# Altium project Shuttler_AMC.PrjPcb (part 7 of 20)

## Sheet PWR_DC_DC_EXAR2.SchDoc: Sayma AMC
size 420 x 297 mm; $$Internal___BlkDate: 0:12:25_2-9-18; $$Internal_NAME_PLACEHOLDER: a3sheet; $$Internal_Resolution: 00001mm; $$NotCommonProperty_@NAME: PWR_DC_DC_EXAR; $$NotCommonProperty_@PRINTORDER: 2; $$NotCommonProperty_@SHEET: 1; $$NotCommonProperty_@SHEETTOTAL: 1; CmpIndex: 9; Drawing Author: G.Kasprowicz; Drawing Number: Sayma AMC; Drawing Project: AMC FMC Carrier Board; Drawing Revision: 2.0; SymIndex: 2141; CheckedBy: P.Kulik,T.Przywozki,W.Ruclo; Author: G.Kasprowicz; CompanyName: WUT ISE; DrawnBy: G.Kasprowicz; Organization: WUT ISE; Address1: PW ISE; Address2: Nowowiejska 15/19 00-665 Warsaw; Address3: gkasprow@gmail.com; DocumentNumber: 14; Revision: 2; SheetNumber: 14; SheetTotal: 32; ModifiedBy: -; CheckedDate: -; Title2: Exar & 5V supply; DivGrp: WUT ISE; Designer: G.Kasprowicz; ModifiedDate: -; ProjectName: Sensor Box
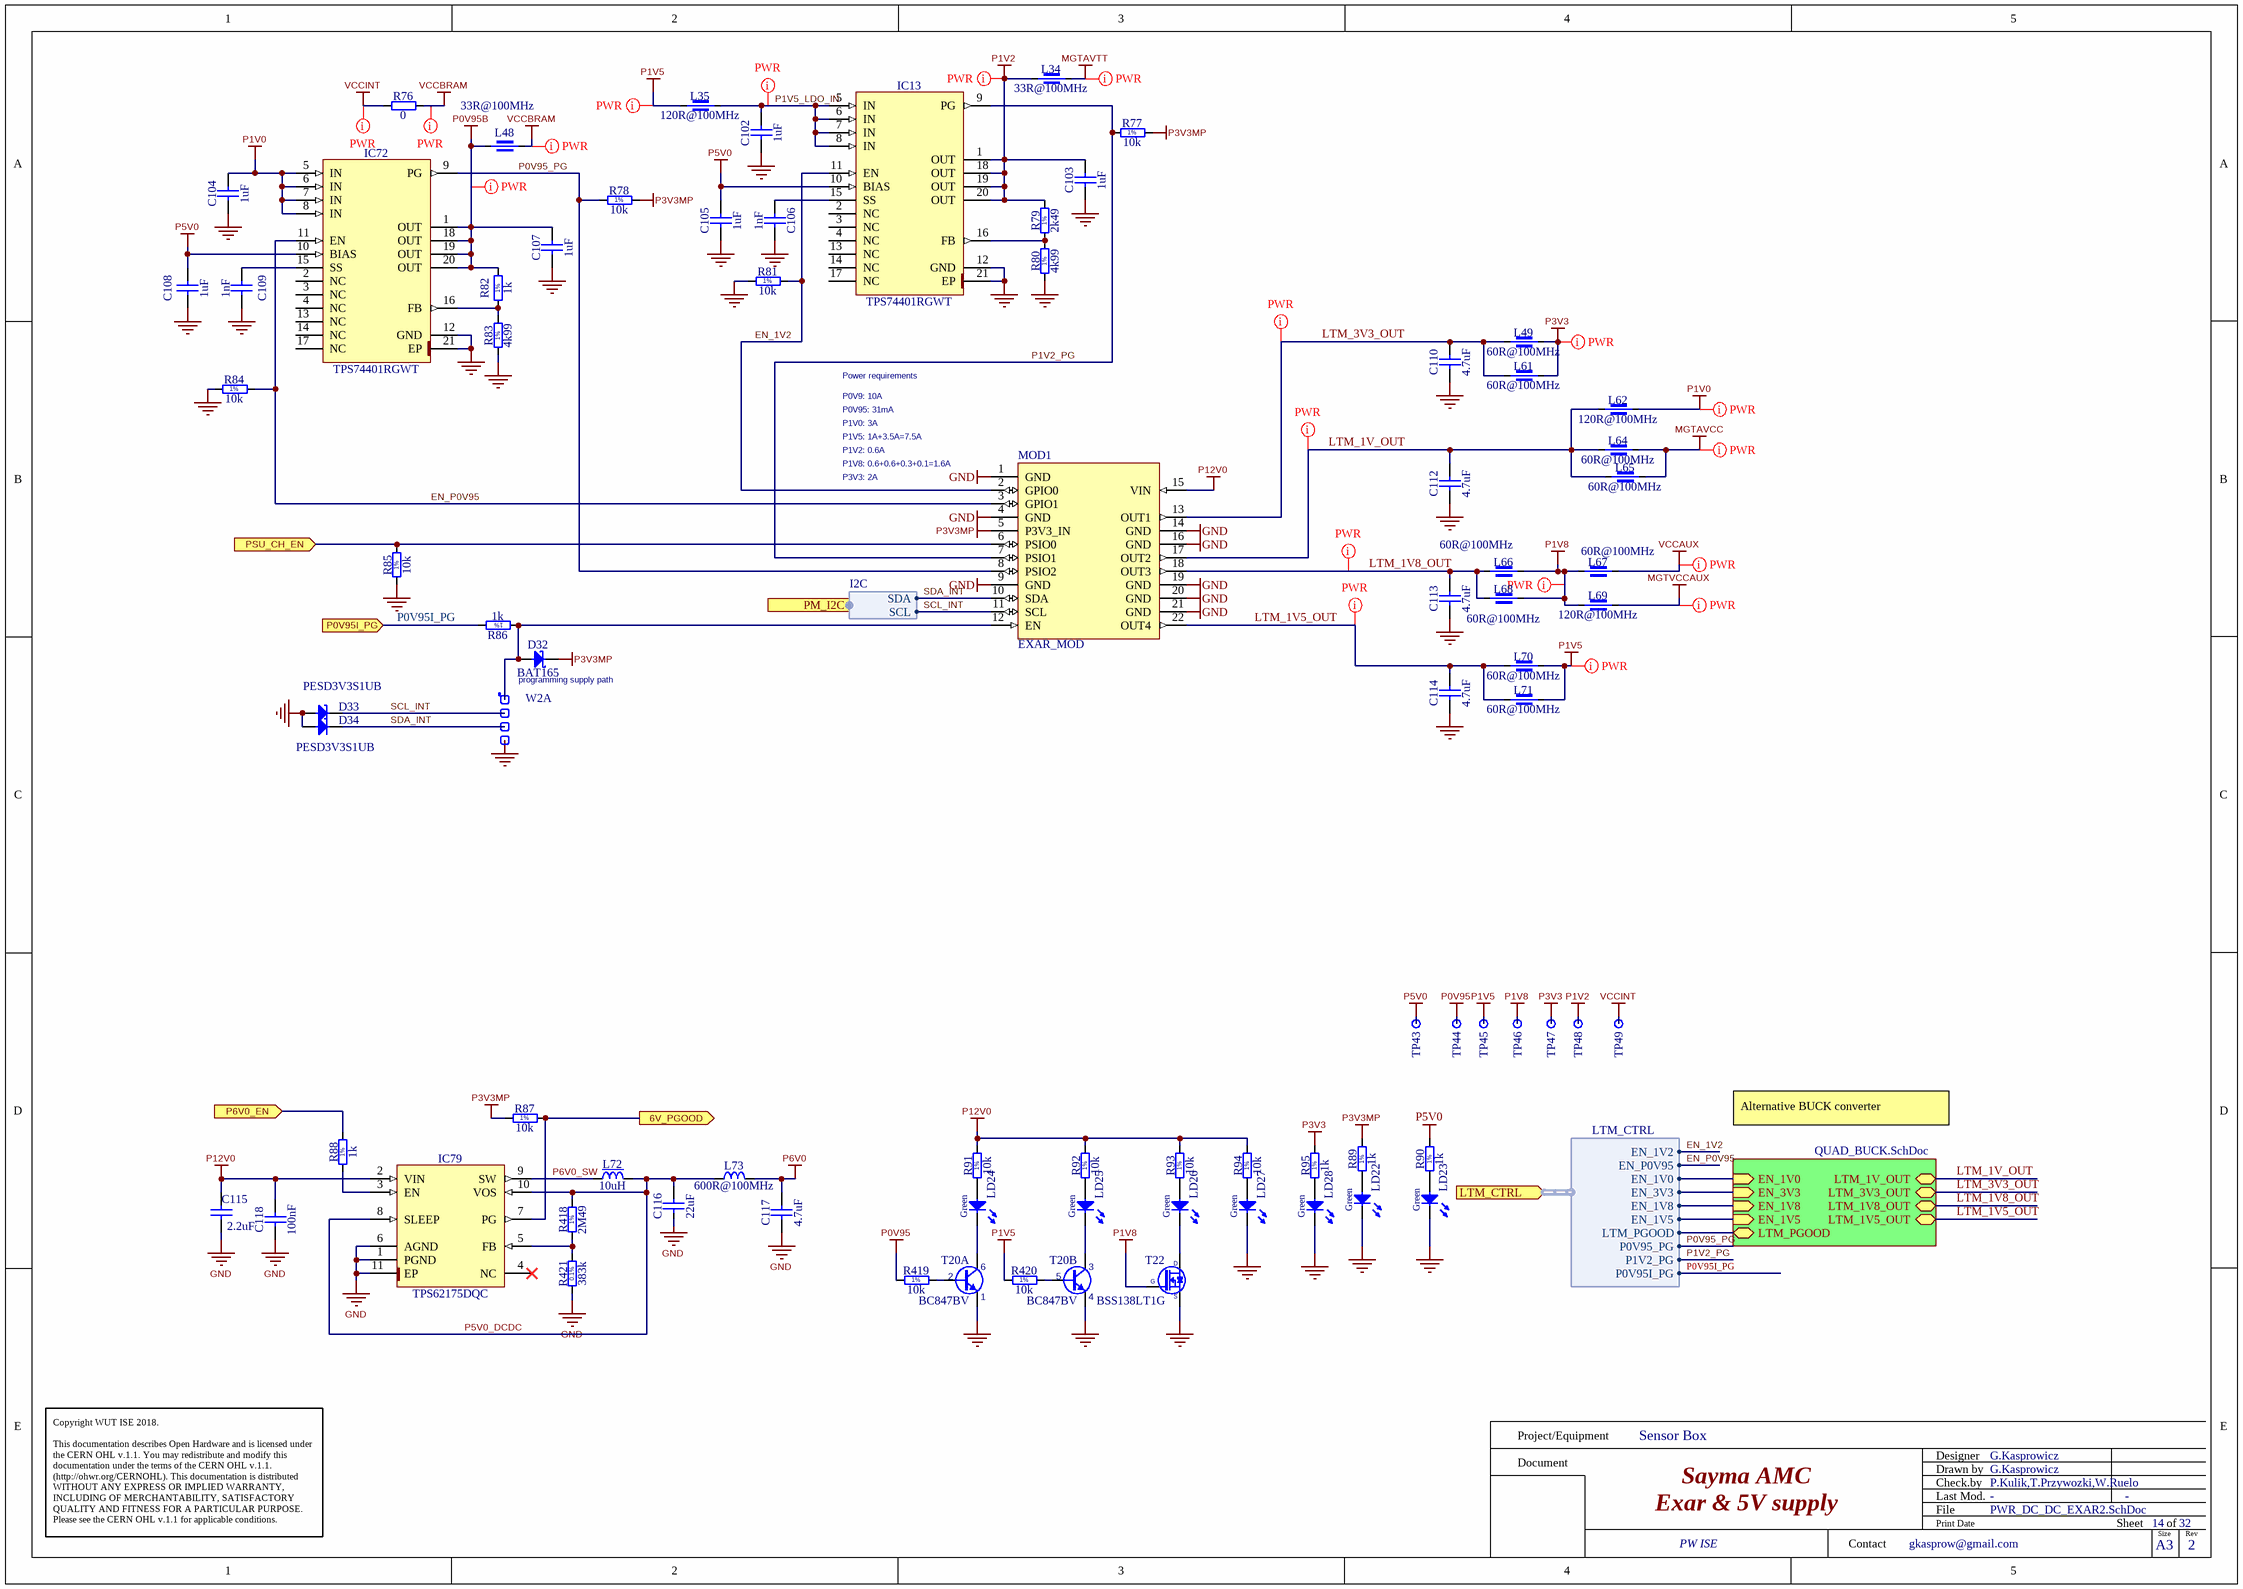
[diagram p12: PWR_DC_DC_EXAR2.SchDoc]

### Parts
C102  1uF  [CAPC1005X55N]
C103  1uF  [CAPC1005X55N]
C104  1uF  [CAPC1005X55N]
C105  1uF  [CAPC1005X55N]
C106  1nF  [CAPC1005X55N]
C107  1uF  [CAPC1005X55N]
C108  1uF  [CAPC1005X55N]
C109  1nF  [CAPC1005X55N]
C110  4.7uF  [CAPC1709X95N]
C112  4.7uF  [CAPC1709X95N]
C113  4.7uF  [CAPC1709X95N]
C114  4.7uF  [CAPC1709X95N]
C115  2.2uF  [CAPC1005X55N]
C116  22uF  [CAPC2012X135N]
C117  4.7uF  [CAPC1709X95N]
C118  100nF  [CAPC1005X55N]
D32  BAT165  [SOD2512X110N]
D33  PESD3V3S1UB  [SODFL1608X65N]
D34  PESD3V3S1UB  [SODFL1608X65N]
IC13  TPS74401RGWT  [QFN65P500X500X100-21N-S325]
IC72  TPS74401RGWT  [QFN65P500X500X100-21N-S325]
IC79  TPS62175DQC  [SON50P200X300X80-11N-R94X250]
L34  33R@100MHz  [INDC1608X95N]
L35  120R@100MHz  [INDC1608X95N]
L48  33R@100MHz  [INDC1608X95N]
L49  60R@100MHz  [INDC4516X180N]
L61  60R@100MHz  [INDC4516X180N]
L62  120R@100MHz  [INDC1608X95N]
L64  60R@100MHz  [INDC4516X180N]
L65  60R@100MHz  [INDC4516X180N]
L66  60R@100MHz  [INDC4516X180N]
L67  60R@100MHz  [INDC4516X180N]
L68  60R@100MHz  [INDC4516X180N]
L69  120R@100MHz  [INDC1608X95N]
L70  60R@100MHz  [INDC4516X180N]
L71  60R@100MHz  [INDC4516X180N]
L72  10uH  [IND_WURTH_WE-SPC-4838]
L73  600R@100MHz  [INDC2012X110N]
LD22  Green  [LED_KINGBRIGHT_KPH-1608CGCK]
LD23  Green  [LED_KINGBRIGHT_KPH-1608CGCK]
LD24  Green  [LED_KINGBRIGHT_KPH-1608CGCK]
LD25  Green  [LED_KINGBRIGHT_KPH-1608CGCK]
LD26  Green  [LED_KINGBRIGHT_KPH-1608CGCK]
LD27  Green  [LED_KINGBRIGHT_KPH-1608CGCK]
LD28  Green  [LED_KINGBRIGHT_KPH-1608CGCK]
MOD1  EXAR_MOD  [EXAR_MOD]
R76  0  [RESC2012X60N]
R77  10k  [RESC1005X40N]
R78  10k  [RESC1005X40N]
R79  2k49  [RESC1608X55N]
R80  4k99  [RESC1608X55N]
R81  10k  [RESC1005X40N]
R82  1k  [RESC1005X40N]
R83  4k99  [RESC1608X55N]
R84  10k  [RESC1005X40N]
R85  10k  [RESC1005X40N]
R86  1k  [RESC1005X40N]
R87  10k  [RESC1005X40N]
R88  1k  [RESC1005X40N]
R89  1k  [RESC1005X40N]
R90  1k  [RESC1005X40N]
R91  10k  [RESC1005X40N]
R92  10k  [RESC1005X40N]
R93  10k  [RESC1005X40N]
R94  10k  [RESC1005X40N]
R95  1k  [RESC1005X40N]
R418  2M49  [RESC1608X55N]
R419  10k  [RESC1005X40N]
R420  10k  [RESC1005X40N]
R421  383k  [RESC1608X55N]
T20  BC847BV  [SOTFL50P160X60-6N]  (parts A,B of 2)
T22  BSS138LT1G  [SOT95P240X110-3N]
TP43  Test Point  [TPS127]  (value not drawn)
TP44  Test Point  [TPS127]  (value not drawn)
TP45  Test Point  [TPS127]  (value not drawn)
TP46  Test Point  [TPS127]  (value not drawn)
TP47  Test Point  [TPS127]  (value not drawn)
TP48  Test Point  [TPS127]  (value not drawn)
TP49  Test Point  [TPS127]  (value not drawn)
W2  Header 4  [SAMTEC_MTLW-104-07-L-S-250]  (value not drawn)  (parts A,D of 4)
W11  Header 4  [SAMTEC_MTLW-104-07-L-S-250]  (value not drawn)  (parts B,C of 4)

### Sub-sheets
U_QUAD_BUCK = QUAD_BUCK.SchDoc: LTM_1V_OUT (bidir), LTM_1V5_OUT (bidir), EN_1V0 (in), EN_1V5 (in), EN_3V3 (in), EN_1V8 (in), LTM_PGOOD (bidir), LTM_3V3_OUT (bidir), LTM_1V8_OUT (bidir)

### Ports
6V_PGOOD (out), LTM_CTRL (in, harness LTM_CTRL), P0V95I_PG (in), P6V0_EN (in), PM_I2C (harness I2C), PSU_CH_EN (in)

### Harnesses
LTM_CTRL: EN_1V0, EN_3V3, EN_1V8, EN_1V5, LTM_PGOOD, EN_1V2, EN_P0V95, P0V95_PG, P1V2_PG, P0V95I_PG
I2C: SCL, SDA

### Nets
GND: C102.1 C103.1 C104.1 C105.1 C106.2 C107.1 C108.1 C109.2 C110.1 C112.1 C113.1 C114.1 C115.1 C116.1 C117.1 C118.1 D33.2(A) D34.2(A) IC13.12(GND) IC13.21(EP) IC72.12(GND) IC72.21(EP) IC79.1(PGND) IC79.6(AGND) IC79.11(EP) LD22.1(C) LD23.1(C) LD27.1(C) LD28.1(C) MOD1.1(GND) MOD1.4(GND) MOD1.9(GND) MOD1.14(GND) MOD1.16(GND) MOD1.19(GND) MOD1.20(GND) MOD1.21(GND) R80.1 R81.1 R83.1 R84.1 R85.1 R421.1 T20.1(E) T20.4(E) T22.2(S) W2.4
MGTAVCC: L64.2 L65.2
MGTAVTT: L34.2
MGTVCCAUX: L69.1
P0V95: R419.1 TP44.1
P0V95B: C107.2 IC72.1(OUT) IC72.18(OUT) IC72.19(OUT) IC72.20(OUT) L48.1 R82.2
P1V0: C104.2 IC72.5(IN) IC72.6(IN) IC72.7(IN) IC72.8(IN) L62.1
P1V2: C103.2 IC13.1(OUT) IC13.18(OUT) IC13.19(OUT) IC13.20(OUT) L34.1 R79.2 TP48.1
P1V5: L35.2 L70.2 L71.2 R420.1 TP45.1
P1V8: L66.2 L67.1 L68.2 L69.2 T22.1(G) TP46.1
P3V3: L49.2 L61.2 R95.2 TP47.1
P3V3MP: D32.1(C) MOD1.5(P3V3_IN) R77.2 R78.2 R87.1 R89.2
P5V0: C105.2 C108.2 IC13.10(BIAS) IC72.10(BIAS) R90.2 TP43.1
P6V0: C117.2 L73.2
P12V0: C115.2 C118.2 IC79.2(VIN) MOD1.15(VIN) R91.2 R92.2 R93.2 R94.2
VCCAUX: L67.2
VCCBRAM: L48.2 R76.2
VCCINT: R76.1 TP49.1
EN_1V0: sheet U_QUAD_BUCK/EN_1V0, port LTM_CTRL.EN_1V0
EN_1V2: IC13.11(EN) MOD1.2(GPIO0) R81.2 ; port LTM_CTRL.EN_1V2
EN_1V5: sheet U_QUAD_BUCK/EN_1V5, port LTM_CTRL.EN_1V5
EN_1V8: sheet U_QUAD_BUCK/EN_1V8, port LTM_CTRL.EN_1V8
EN_3V3: sheet U_QUAD_BUCK/EN_3V3, port LTM_CTRL.EN_3V3
EN_P0V95: IC72.11(EN) MOD1.3(GPIO1) R84.2 ; port LTM_CTRL.EN_P0V95
EN_P6V0: R88.2 ; port P6V0_EN
EN_PSU_CH: MOD1.6(PSIO0) R85.2 ; port PSU_CH_EN
LTM_1V5_OUT: C114.2 L70.1 L71.1 MOD1.22(OUT4) ; sheet U_QUAD_BUCK/LTM_1V5_OUT
LTM_1V8_OUT: C113.2 L66.1 L68.1 MOD1.18(OUT3) ; sheet U_QUAD_BUCK/LTM_1V8_OUT
LTM_1V_OUT: C112.2 L62.2 L64.1 L65.1 MOD1.17(OUT2) ; sheet U_QUAD_BUCK/LTM_1V_OUT
LTM_3V3_OUT: C110.2 L49.1 L61.1 MOD1.13(OUT1) ; sheet U_QUAD_BUCK/LTM_3V3_OUT
LTM_PGOOD: sheet U_QUAD_BUCK/LTM_PGOOD, port LTM_CTRL.LTM_PGOOD
P0V95_PG: IC72.9(PG) MOD1.8(PSIO2) R78.1 ; port LTM_CTRL.P0V95_PG
P0V95I_PG: R86.2 ; port P0V95I_PG, port LTM_CTRL.P0V95I_PG
P1V2_PG: IC13.9(PG) MOD1.7(PSIO1) R77.1 ; port LTM_CTRL.P1V2_PG
P1V5_LDO_IN: C102.2 IC13.5(IN) IC13.6(IN) IC13.7(IN) IC13.8(IN) L35.1
P5V0_DCDC: C116.2 IC79.8(SLEEP) IC79.10(VOS) L72.2 L73.1 R418.2
P6V0_SW: IC79.9(SW) L72.1
PGOOD_P6V0: IC79.7(PG) R87.2 ; port 6V_PGOOD
SCL_INT: D33.1(C) MOD1.11(SCL) W11.2 ; port PM_I2C.SCL  [project net PM_I2C.SCL]
SDA_INT: D34.1(C) MOD1.10(SDA) W11.3 ; port PM_I2C.SDA  [project net PM_I2C.SDA]
NetC106_1: C106.1 IC13.15(SS)
NetC109_1: C109.1 IC72.15(SS)
NetD32_2: D32.2(A) MOD1.12(EN) R86.1 W2.1
NetIC13_16: IC13.16(FB) R79.1 R80.2
NetIC72_16: IC72.16(FB) R82.1 R83.2
NetIC79_3: IC79.3(EN) R88.1
NetIC79_5: IC79.5(FB) R418.1 R421.2
NetLD22_2: LD22.2(A) R89.1
NetLD23_2: LD23.2(A) R90.1
NetLD24_1: LD24.1(C) T20.6(C)
NetLD24_2: LD24.2(A) R91.1
NetLD25_1: LD25.1(C) T20.3(C)
NetLD25_2: LD25.2(A) R92.1
NetLD26_1: LD26.1(C) T22.3(D)
NetLD26_2: LD26.2(A) R93.1
NetLD27_2: LD27.2(A) R94.1
NetLD28_2: LD28.2(A) R95.1
NetR419_2: R419.2 T20.2(B)
NetR420_2: R420.2 T20.5(B)

Not connected (* = marked no-connect by the designer): IC13 2(NC) 3(NC) 4(NC) 13(NC) 14(NC) 17(NC); IC72 2(NC) 3(NC) 4(NC) 13(NC) 14(NC) 17(NC); IC79 4(NC)*

### Layout directives
net class PWR: LTM_1V5_OUT, LTM_1V8_OUT, LTM_1V_OUT, LTM_3V3_OUT, MGTAVCC, MGTAVTT, MGTVCCAUX, P0V95B, P1V0, P1V2, P1V5, P1V5_LDO_IN, P1V8, P3V3, VCCAUX, VCCBRAM, VCCINT

### Notes on the sheet
- Power requirements
- P0V9: 10A
- P1V0: 3A
- P0V95: 31mA
- P1V5: 1A+3.5A=7.5A
- P1V2: 0.6A
- P3V3: 2A
- P1V8: 0.6+0.6+0.3+0.1=1.6A
- programming supply path
- Alternative BUCK converter
- Project/Equipment
- Document
- Designer
- Drawn by
- Check.by
- Copyright WUT ISE 2018.
  This documentation describes Open Hardware and is licensed under the CERN OHL v.1.1. You may redistribute and modify this documentation under the terms of the CERN OHL v.1.1. (http://ohwr.org/CERNOHL). This documentation is distributed WITHOUT ANY EXPRESS OR IMPLIED WARRANTY, INCLUDING OF MERCHANTABILITY, SATISFACTORY QUALITY AND FITNESS FOR A PARTICULAR PURPOSE. Please see the CERN OHL v.1.1 for applicable conditions.
- Contact
- File
- Last Mod.
- Print Date
- Sheet
- Size
- A3
- of
- Rev
- (in symbol R0402_1K_1%_0.0625W_100PPM) 1%
- (in symbol R0402_10K_1%_0.0625W_100PPM) 1%
- (in symbol R0603_2K49_1%_0.063W_50PPM) 1%
- (in symbol R0603_2M49_1%_0.1W_100PPM) 1%
- (in symbol R0603_4K99_1%_0.063W_50PPM) 1%
- (in symbol R0603_383K_0.1%_0.063W_25PPM) 0.1%

### Library data of the parts
C102-C105 C107 C108 = CC0402_1UF_16V_10%_X5R: as C126 on sheet DAC_supply; Manufacturer Part Number: CC0402_1UF_16V_10%_X5R; Part Number: CC0402_1UF_16V_10%_X5R; Value: 1uF; Component Kind: Standard; Component Type: Standard; Pin Count: 2; Status: Preferred; Case: 0402; Mounted: Yes; Socket: No; SMD: Yes; Sense: No; Manufacturer1 Example: TDK; Manufacturer1 ComponentHeight: 0.55mm; HelpURL: \\cern.ch\dfs\Applications\Altium\Datasheets\CC0402_X5R_TDK_C.pdf; Author: CERN DEM JLC; CreateDate: 25.10.2012; LatestRevisionDate: 25.10.2012
C106 C109 = CC0402_1NF_50V_10%_X7R: as C650 on sheet PWR_Buck_4V_20A; Manufacturer Part Number: CC0402_1NF_50V_10%_X7R; Part Number: CC0402_1NF_50V_10%_X7R; Value: 1nF; Component Kind: Standard; Component Type: Standard; Pin Count: 2; Status: Not Recommended; Case: 0402; Mounted: Yes; Socket: No; SMD: Yes; Sense: No; Manufacturer1 Example: PHYCOMP; Manufacturer1 ComponentHeight: 0.55mm; HelpURL: \\cern.ch\dfs\Applications\Altium\Datasheets\CC0402_X7R_PHYCOMP.pdf; Author: CERN DEM JLC; CreateDate: 03.12.2007; LatestRevisionDate: 03.12.2007
C110 C112-C114 C117 = CC0603_4.7UF_16V_10%_X5R: Non-polarised capacitor; Manufacturer: GENERIC; Part Description: SMD Multilayer Chip Ceramic Capacitor; Manufacturer1 Part Number: EMK107ABJ475KA-T; Tolerance: ±10%; Voltage: 16V; TC: X5R; Manufacturer Part Number: CC0603_4.7UF_16V_10%_X5R; Part Number: CC0603_4.7UF_16V_10%_X5R; Value: 4.7uF; Component Kind: Standard; Component Type: Standard; Pin Count: 2; Status: None; Case: 0603; Mounted: Yes; Socket: No; SMD: Yes; Sense: No; Manufacturer1 Example: TAIYO YUDEN; Manufacturer1 ComponentHeight: 0.95mm; HelpURL: \\cern.ch\dfs\Applications\Altium\Datasheets\CC0603_X7R_TAIYO-YUDEN_HIGH-VALUE.pdf; Author: CERN DEM JLC; CreateDate: 16.12.2013; LatestRevisionDate: 16.09.2014
C115 = CC0402_2.2UF_6.3V_10%_X5R: Non-polarised capacitor; Part Description: SMD Multilayer Chip Ceramic Capacitor; Manufacturer: GENERIC; Manufacturer1 Part Number: C1005X5R0J225K050BC; Voltage: 6.3V; TC: X5R; Tolerance: ±10%; Part Number: CC0402_2.2UF_6.3V_10%_X5R; Component Kind: Standard; Component Type: Standard; Pin Count: 2; Value: 2.2uF; Status: Preferred; Manufacturer Part Number: CC0402_2.2UF_6.3V_10%_X5R; Case: 0402; Mounted: Yes; Socket: No; SMD: Yes; Sense: No; Manufacturer1 Example: TDK; Manufacturer1 ComponentHeight: 0.55mm; HelpURL: \\cern.ch\dfs\Applications\Altium\Datasheets\CC0402_X5R_TDK_C.pdf; Author: CERN DEM JMW; CreateDate: 22.09.2015; LatestRevisionDate: 22.09.2015
C116 = CC0805_22UF_16V_10%_X5R: Non-polarised capacitor; Manufacturer: GENERIC; Part Description: SMD Multilayer Chip Ceramic Capacitor; Manufacturer1 Part Number: C2012X5R1C226KT; Tolerance: ±10%; Voltage: 16V; TC: X5R; Manufacturer Part Number: CC0805_22UF_16V_10%_X5R; Part Number: CC0805_22UF_16V_10%_X5R; Value: 22uF; Component Kind: Standard; Component Type: Standard; Pin Count: 2; Status: Preferred; Case: 0805; Mounted: Yes; Socket: No; SMD: Yes; Sense: No; Manufacturer1 Example: TDK; Manufacturer1 ComponentHeight: 1.35mm; HelpURL: \\cern.ch\dfs\Applications\Altium\Datasheets\CC0805_X5R_TDK_C.pdf; Author: CERN DEM JLC; CreateDate: 25.10.2012; LatestRevisionDate: 25.10.2012
C118 = CC0402_100NF_16V_10%_X5R: as C646 on sheet PWR_Buck_4V_20A; Manufacturer Part Number: CC0402_100NF_16V_10%_X5R; Part Number: CC0402_100NF_16V_10%_X5R; Value: 100nF; Component Kind: Standard; Component Type: Standard; Pin Count: 2; Status: None; Case: 0402; Mounted: Yes; Socket: No; SMD: Yes; Sense: No; Manufacturer1 Example: MURATA; Manufacturer1 ComponentHeight: 0.55mm; HelpURL: \\cern.ch\dfs\Applications\Altium\Datasheets\CC0402_X5R_MURATA_GRM.pdf; Author: CERN DEM JLC; CreateDate: 10.12.2013; LatestRevisionDate: 10.12.2013
D32 = BAT165: Schottky Diode; Manufacturer: INFINEON; Part Description: Medium Power AF Schottky Diode; Voltage: 40V; Power: 750mA; PressFit: No; Bonding: No; Manufacturer Part Number: BAT165; PackageDescription: Small Outline Diode (SOD-323), 1.70mm W X 1.25mm L X 1.10mm H body,  IPC Medium Density; Part Number: BAT165; Component Kind: Standard; Component Type: Standard; Device: BAT165; Pin Count: 2; Case: SOD323; Mounted: Yes; Socket: No; SMD: Yes; Sense: No; ComponentHeight: 1.1mm; HelpURL: \\cern.ch\dfs\Applications\Altium\Datasheets\BAT165.pdf; Author: CERN DEM JLC; CreateDate: 12.11.2014; LatestRevisionDate: 12.11.2014
D33 D34 = PESD3V3S1UB: ESD protection diode; Manufacturer: NXP SEMICONDUCTORS; Part Description: ESD protection diode (23kV); Voltage: 3V3; Power: 330W; PressFit: No; Bonding: No; Manufacturer Part Number: PESD3V3S1UB; PackageDescription: Ultra Small Outline Diode Flat Lead (SOD-523), Body; 1.2mm L X 0.8mm W X 0.65mm H, IPC Medium Density; Part Number: PESD3V3S1UB; Component Kind: Standard; Component Type: Standard; Device: PESD3V3S1UB; Pin Count: 2; Case: SOD523; Mounted: Yes; Socket: No; SMD: Yes; Sense: No; ComponentHeight: 0.65mm; HelpURL: \\cern.ch\dfs\Applications\Altium\Datasheets\PESD3V3S1UB.pdf; Author: CERN DEM JLC; CreateDate: 29.11.2012; LatestRevisionDate: 29.11.2012
IC13 IC72 = TPS74401RGWT: Single Output LDO, 3.0A, Adj.(0.8 to 3.3V), Fast Transient Response, Programmable SoftStart; Manufacturer: TEXAS INSTRUMENTS; PressFit: No; Bonding: No; Manufacturer Part Number: TPS74401RGWT; PackageDescription: QFN, 0.65mm pitch,square; 20 pin, 5mm X 5mm X 1mm H body (w/thermal tab 3.25 X 3.25mm),  IPC Medium Density; Part Description: Single Output LDO, 3.0A, Adj.(0.8 to 3.3V), Fast Transient Response, Programmable SoftStart; Part Number: TPS74401RGWT; Component Kind: Standard; Component Type: Standard; Device: TPS74401RGWT; Pin Count: 21; Case: QFN20; Mounted: Yes; Socket: No; SMD: Yes; Sense: No; ComponentHeight: 1mm; HelpURL: \\cern.ch\dfs\Applications\Altium\Datasheets\TPS74401RGWT.pdf; Author: CERN DEM JLC; CreateDate: 02.02.2010; LatestRevisionDate: 02.02.2010
IC79 = TPS62175DQC: 4.75-28VDC to 1-6VDC, 500mA Step-Down Converter With Sleep Mode; Manufacturer: TEXAS INSTRUMENTS; PressFit: No; Bonding: No; Manufacturer Part Number: TPS62175DQC; PackageDescription: SON, 10-Leads, Body 2x3mm, Pitch 0.5mm, Thermal Pad 0.94x2.5mm, IPC Medium Density; Part Description: 4.75-28VDC to 1-6VDC, 500mA Step-Down Converter With Sleep Mode; Part Number: TPS62175DQC; Component Kind: Standard; Component Type: Standard; Device: TPS62175DQC; Pin Count: 11; Case: SON10; Mounted: Yes; Socket: No; SMD: Yes; Sense: No; ComponentHeight: 0.8mm; HelpURL: \\cern.ch\dfs\Applications\Altium\Datasheets\TPS62175DQC.pdf; Author: CERN DEM JMW; CreateDate: 11.08.2015; LatestRevisionDate: 11.08.2015
L34 L48 = IND0603_MURATA_BLM18PG330SN1D: Manufacturer: MURATA; Part Description: SMD EMIFIL Chip Ferrite Bead; Tolerance: ±25%; Power: 3A; Resistance: 0.025R; Manufacturer Part Number: BLM18PG330SN1D; Part Number: IND0603_MURATA_BLM18PG330SN1D; Value: 33R@100MHz; Component Kind: Standard; Component Type: Standard; Pin Count: 2; Status: None; Case: 0603; Mounted: Yes; Socket: No; SMD: Yes; Sense: No; ComponentHeight: 0.95mm; HelpURL: \\cern.ch\dfs\Applications\Altium\Datasheets\IND0603_MURATA_BLM18P.pdf; Author: CERN DEM JMW; CreateDate: 19.02.2014; LatestRevisionDate: 25.10.2018
L35 L62 L69 = IND0603_MURATA_BLM18PG121SN1D: Manufacturer: MURATA; Part Description: SMD EMIFIL Chip Ferrite Bead; Power: 2A; Resistance: 0.05R; Manufacturer Part Number: BLM18PG121SN1D; Part Number: IND0603_MURATA_BLM18PG121SN1D; Value: 120R@100MHz; Component Kind: Standard; Component Type: Standard; Pin Count: 2; Status: None; Case: 0603; Mounted: Yes; Socket: No; SMD: Yes; Sense: No; ComponentHeight: 0.95mm; HelpURL: \\cern.ch\dfs\Applications\Altium\Datasheets\IND0603_MURATA_BLM18P.pdf; Author: CERN DEM BC; CreateDate: 27.07.2015; LatestRevisionDate: 25.10.2018
L49 L61 L64-L68 L70 L71 = IND1806_MURATA_BLM41PG600SN1L: Manufacturer: MURATA; Part Description: SMD EMI Suppression Chip Ferrite Bead (BLM41P Series); Power: 6A; Resistance: 0.01R; Manufacturer Part Number: BLM41PG600SN1L; Part Number: IND1806_MURATA_BLM41PG600SN1L; Value: 60R@100MHz; Component Kind: Standard; Component Type: Standard; Pin Count: 2; Status: None; Case: 1806; Mounted: Yes; Socket: No; SMD: Yes; Sense: No; ComponentHeight: 1.8mm; HelpURL: \\cern.ch\dfs\Applications\Altium\Datasheets\IND1806_MURATA_BLM41P.pdf; Author: CERN DEM JLC; CreateDate: 02.12.2009; LatestRevisionDate: 02.12.2009
L72 = IND_10UH_20%_WURTH_WE-SPC_74408943100: Inductor With Core; Part Description: SMD Shielded Power Inductor (WE-SPC Series); Manufacturer: WURTH ELEKTRONIK; Power: 1.65A; Resistance: 0.082R; Tolerance: ±20%; Part Number: IND_10UH_20%_WURTH_WE-SPC_74408943100; Component Kind: Standard; Component Type: Standard; Pin Count: 2; Value: 10uH; Status: None; Manufacturer Part Number: 74408943100; Mounted: Yes; Socket: No; SMD: Yes; Sense: No; ComponentHeight: 4.1mm; HelpURL: \\cern.ch\dfs\Applications\Altium\Datasheets\IND_WURTH_WE-SPC_74408943100.pdf; Author: CERN DEM MR; CreateDate: 30.06.2017; LatestRevisionDate: 05.07.2017
L73 = IND0805_WURTH_742792040: Inductor; Manufacturer: WURTH ELEKTRONIK; Part Description: SMD EMI Suppression Chip Ferrite Bead (WE-CBF Series); Tolerance: ±25%; Power: 2A; Resistance: 0.150R; Manufacturer Part Number: 742792040; Part Number: IND0805_WURTH_742792040; Value: 600R@100MHz; Component Kind: Standard; Component Type: Standard; Pin Count: 2; Status: None; Case: 0805; Mounted: Yes; Socket: No; SMD: Yes; Sense: No; ComponentHeight: 1.1mm; HelpURL: \\cern.ch\dfs\Applications\Altium\Datasheets\IND0805_WURTH_742792040.pdf; Author: CERN DEM JLC; CreateDate: 10.05.2010; LatestRevisionDate: 10.05.2010
LD22-LD28 = LED_KINGBRIGHT_KPH-1608CGCK: LED Green 1C 2A; Part Description: SMD Green LED, Case 1.6mmX0.8mm(0603), 0.65mm Thickness; PressFit: No; Bonding: No; Manufacturer Part Number: KPH-1608CGCK; Manufacturer: KINGBRIGHT; PackageDescription: SMT Green LED, Case 0603, Body L 1.6 x W 0.8mm H 0.65mm; Part Number: LED_KINGBRIGHT_KPH-1608CGCK; Component Kind: Standard; Component Type: Standard; Color: Green; Pin Count: 2; Mounted: Yes; Socket: No; SMD: Yes; Sense: No; ComponentHeight: 0.65mm; HelpURL: \\cern.ch\dfs\Applications\Altium\Datasheets\LED_KINGBRIGHT_KPH-1608CGCK.pdf; Author: CERN DEM JLC; CreateDate: 03.07.2017; LatestRevisionDate: 03.07.2017
MOD1 = DC/DC_EXAR_MOD: 4 channel PCB module based on XRP7724ILB-F
R76 = R0805_0R_JUMPER: Resistor; Part Description: 2A (0.05R Max DC Resistance) Zero Ohm Jumper; Manufacturer: GENERIC; Manufacturer1 Part Number: NRC10Z0; PressFit: No; Part Number: R0805_0R_JUMPER; Component Kind: Standard; Component Type: Standard; Pin Count: 2; Value: 0; Status: Preferred; Manufacturer Part Number: R0805_0R_JUMPER; Case: 0805; Mounted: Yes; Sense: No; Socket: No; SMD: Yes; Manufacturer1 Example: NIC COMPONENT; Manufacturer1 ComponentHeight: 0.6mm; HelpURL: \\cern.ch\dfs\Applications\Altium\Datasheets\R0805_NIC_NRC.pdf; Author: CERN DEM JLC; CreateDate: 03.12.2007; LatestRevisionDate: 13.03.2008
R77 R78 R81 R84 R85 R87 R91-R94 R419 R420 = R0402_10K_1%_0.0625W_100PPM: as R103 on sheet DAC_supply; Manufacturer Part Number: R0402_10K_1%_0.0625W_100PPM; Part Number: R0402_10K_1%_0.0625W_100PPM; Tolerance: ±1%; Value: 10k; Component Kind: Standard; Component Type: Standard; Pin Count: 2; Status: Not Recommended; Power: 0.0625W; Case: 0402; Mounted: Yes; Sense: No; Socket: No; SMD: Yes; Manufacturer1 Example: YAGEO PHYCOMP; Manufacturer1 ComponentHeight: 0.4mm; HelpURL: \\cern.ch\dfs\Applications\Altium\Datasheets\R0402_Phycomp_RC0402.pdf; Author: CERN DEM JLC; CreateDate: 03.12.2007; LatestRevisionDate: 17.10.2012
R79 = R0603_2K49_1%_0.063W_50PPM: Resistor - 1%; Manufacturer: GENERIC; Part Description: General Purpose Thick Film Chip Resistor; Manufacturer1 Part Number: CPF0603F2K49C1; Power: 0.1W; TC: ±50ppm/°C; PressFit: No; Manufacturer Part Number: R0603_2K49_1%_0.063W_50PPM; Part Number: R0603_2K49_1%_0.063W_50PPM; Tolerance: ±1%; Value: 2k49; Component Kind: Standard; Component Type: Standard; Pin Count: 2; Status: None; Case: 0603; Mounted: Yes; Sense: No; Socket: No; SMD: Yes; Manufacturer1 Example: TYCO NEOHM; Manufacturer1 ComponentHeight: 0.55mm; HelpURL: \\cern.ch\dfs\Applications\Altium\Datasheets\R0603_TYCO_CPF.pdf; Author: CERN DEM JLC; CreateDate: 20.05.2010; LatestRevisionDate: 20.05.2010
R80 R83 = R0603_4K99_1%_0.063W_50PPM: Resistor - 1%; Manufacturer: GENERIC; Part Description: General Purpose Thick Film Chip Resistor; Manufacturer1 Part Number: CPF0603F4K99C1; Power: 0.1W; TC: ±50ppm/°C; PressFit: No; Manufacturer Part Number: R0603_4K99_1%_0.063W_50PPM; Part Number: R0603_4K99_1%_0.063W_50PPM; Tolerance: ±1%; Value: 4k99; Component Kind: Standard; Component Type: Standard; Pin Count: 2; Status: None; Case: 0603; Mounted: Yes; Sense: No; Socket: No; SMD: Yes; Manufacturer1 Example: TYCO NEOHM; Manufacturer1 ComponentHeight: 0.55mm; HelpURL: \\cern.ch\dfs\Applications\Altium\Datasheets\R0603_TYCO_CPF.pdf; Author: CERN DEM JLC; CreateDate: 20.05.2010; LatestRevisionDate: 20.05.2010
R82 R86 R88-R90 R95 = R0402_1K_1%_0.0625W_100PPM: as R462 on sheet PWR_Buck_P2V5_8A; Manufacturer Part Number: R0402_1K_1%_0.0625W_100PPM; Part Number: R0402_1K_1%_0.0625W_100PPM; Tolerance: ±1%; Value: 1k; Component Kind: Standard; Component Type: Standard; Pin Count: 2; Status: Not Recommended; Power: 0.0625W; Case: 0402; Mounted: Yes; Sense: No; Socket: No; SMD: Yes; Manufacturer1 Example: YAGEO PHYCOMP; Manufacturer1 ComponentHeight: 0.4mm; HelpURL: \\cern.ch\dfs\Applications\Altium\Datasheets\R0402_Phycomp_RC0402.pdf; Author: CERN DEM JLC; CreateDate: 03.12.2007; LatestRevisionDate: 17.10.2012
R418 = R0603_2M49_1%_0.1W_100PPM: Resistor - 1%; Part Description: General Purpose Thick Film Chip Resistor; Manufacturer: GENERIC; Manufacturer1 Part Number: CRCW06032M49FKEA; Power: 0.1W; TC: ±100ppm/°C; PressFit: No; Part Number: R0603_2M49_1%_0.1W_100PPM; Component Kind: Standard; Component Type: Standard; Pin Count: 2; Value: 2M49; Status: Preferred; Tolerance: ±1%; Manufacturer Part Number: R0603_2M49_1%_0.1W_100PPM; Case: 0603; Mounted: Yes; Sense: No; Socket: No; SMD: Yes; Manufacturer1 Example: VISHAY; Manufacturer1 ComponentHeight: 0.55mm; HelpURL: \\cern.ch\dfs\Applications\Altium\Datasheets\R0603_VISHAY_CRCW e3.pdf; Author: CERN DEM JLC; CreateDate: 19.03.2014; LatestRevisionDate: 19.03.2014
R421 = R0603_383K_0.1%_0.063W_25PPM: Resistor - 0.1%; Part Description: Thin Film Chip Resistor; Manufacturer: GENERIC; Manufacturer1 Part Number: PCF0603PR-383KBT1; Power: 0.063W; TC: ±25ppm; PressFit: No; Part Number: R0603_383K_0.1%_0.063W_25PPM; Component Kind: Standard; Component Type: Standard; Pin Count: 2; Value: 383k; Status: Not Recommended; Tolerance: ±0.1%; Manufacturer Part Number: R0603_383K_0.1%_0.063W_25PPM; Case: 0603; Mounted: Yes; Sense: No; Socket: No; SMD: Yes; Manufacturer1 Example: TT ELECTRONICS; Manufacturer1 ComponentHeight: 0.55mm; HelpURL: \\cern.ch\dfs\Applications\Altium\Datasheets\R0603_TT ELECTRONICS_PCF.pdf; Author: CERN DEM JLC; CreateDate: 04.05.2010; LatestRevisionDate: 25.10.2018
T20 = BC847BV: 45V, 100mA NPN General Purpose Double Transistor; Manufacturer: NXP SEMICONDUCTORS; Part Description: 45V 100mA NPN General Purpose Double Transistor; PressFit: No; Bonding: No; Manufacturer Part Number: BC847BV; PackageDescription: SOTFL (SOT666), 0.50mm, Pitch; 6 Pin, 1.20mm W X 1.60mm L X 0.60mm H Body, IPC Medium Density; Part Number: BC847BV; Component Kind: Standard; Component Type: Standard; Device: BC847BV; Pin Count: 6; Case: SOT666; Mounted: Yes; Socket: No; SMD: Yes; Sense: No; ComponentHeight: 0.6mm; HelpURL: \\cern.ch\dfs\Applications\Altium\Datasheets\BC847BV.pdf; Author: CERN DEM JLC; CreateDate: 01.12.2011; LatestRevisionDate: 01.12.2011
T22 = BSS138LT1G: N-CHANNEL MOSFET WITH DIODE; Manufacturer: ON SEMICONDUCTOR; Part Description: 50V 200mA N-Channel Enhancement Mode Field-Effect Transistor; PressFit: No; Bonding: No; Manufacturer Part Number: BSS138LT1G; PackageDescription: SOT23 3-Leads, Pitch 0.95mm - Body 1.4x3mm, IPC Medium Density; Part Number: BSS138LT1G; Component Kind: Standard; Component Type: Standard; Device: BSS138LT1G; Pin Count: 3; Case: SOT23-3; Mounted: Yes; Socket: No; SMD: Yes; Sense: No; ComponentHeight: 1.11mm; HelpURL: \\cern.ch\dfs\Applications\Altium\Datasheets\BSS138LT1G.pdf; Author: CERN DEM JLC; CreateDate: 23.03.2009; LatestRevisionDate: 23.03.2009
TP43-TP49 = SMD_PAD_1.27X1.27MM: as TP32 on sheet PWR_Buck_4V_20A; Part Number: SMD_PAD_1.27X1.27MM; Component Kind: Standard (No BOM); Component Type: Standard (No BOM); Pin Count: 1; Family: Test Point; Socket: No; SMD: Yes; Sense: No; Status: None; ComponentHeight: 0mm; HelpURL: Undefined; Author: CERN DEM JLC; CreateDate: 12.01.2008; LatestRevisionDate: 12.01.2008; PackageDescription: 1.27mm x 1.27mm PCB Copper Area (SMD Test Point)
W2 W11 = SAMTEC_MTLW-104-07-L-S-250: 4 Mini Wire-Wrap Contact Strip Header; Manufacturer: SAMTEC; Part Description: 4 Contacts, Pitch 2.54mm, Single Row Through Mount Straight Header (Post Lead = 6.35mm, Tail Lead 3.05mm, Insulator 1.52mm); PressFit: No; Manufacturer Part Number: MTLW-104-07-L-S-250; Part Number: SAMTEC_MTLW-104-07-L-S-250; Component Kind: Standard; Component Type: Standard; Pin Count: 4; Family: Header 4; Mounted: Yes; Socket: No; Sense: No; SMD: No; Status: None; ComponentHeight: 7.87mm; HelpURL: \\cern.ch\dfs\Applications\Altium\Datasheets\SAMTEC_MTLW-104-07-L-S-250.pdf; Author: CERN DEM JLC; CreateDate: 13.12.2012; LatestRevisionDate: 13.12.2012

## Sheet QUAD_BUCK.SchDoc: Sayma AMC
size 420 x 297 mm; CheckedBy: P.Kulik,T.Przywozki,W.Ruclo; Author: G.Kasprowicz; CompanyName: WUT ISE; DrawnBy: G.Kasprowicz; Organization: WUT ISE; Address1: PW ISE; Address2: Nowowiejska 15/19 00-665 Warsaw; Address3: gkasprow@gmail.com; DocumentNumber: 15; Revision: 2; SheetNumber: 15; SheetTotal: 32; ModifiedBy: -; CheckedDate: -; Title2: Quad buck converter; DivGrp: WUT ISE; Designer: G.Kasprowicz; ModifiedDate: -; ProjectName: Sensor Box
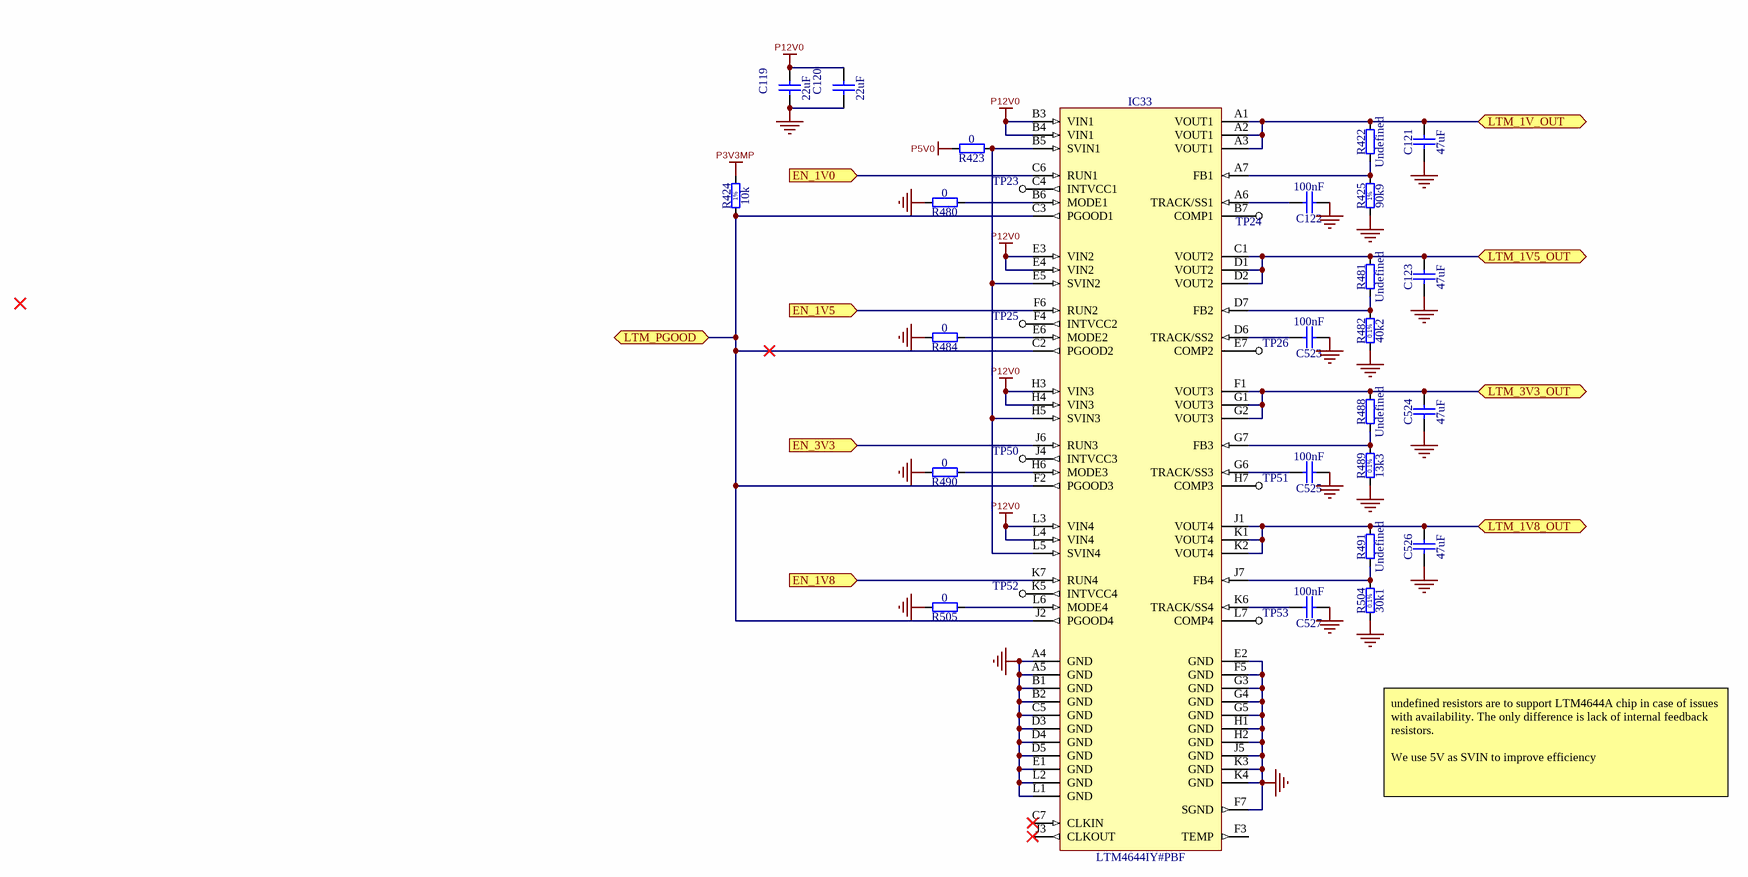
[diagram p13: QUAD_BUCK.SchDoc]

### Parts
C119  22uF  [CAPC2012X135N]
C120  22uF  [CAPC2012X135N]
C121  47uF  [CAPC2012X140N]
C122  100nF  [CAPC1005X55N]
C123  47uF  [CAPC2012X140N]
C523  100nF  [CAPC1005X55N]
C524  47uF  [CAPC2012X140N]
C525  100nF  [CAPC1005X55N]
C526  47uF  [CAPC2012X140N]
C527  100nF  [CAPC1005X55N]
IC33  LTM4644IY#PBF  [BGA77C127P7X11_900X1500X521]
R422  Undefined  [RESC1608X55N]
R423  0  [RESC1005X40N]
R424  10k  [RESC1005X40N]
R425  90k9  [RESC1608X55N]
R480  0  [RESC1005X40N]
R481  Undefined  [RESC1608X55N]
R482  40k2  [RESC1608X55N]
R484  0  [RESC1005X40N]
R488  Undefined  [RESC1608X55N]
R489  13k3  [RESC1608X55N]
R490  0  [RESC1005X40N]
R491  Undefined  [RESC1608X55N]
R504  30k1  [RESC1608X55N]
R505  0  [RESC1005X40N]
TP23  TP  [TP]  (value not drawn)
TP24  TP  [TP]  (value not drawn)
TP25  TP  [TP]  (value not drawn)
TP26  TP  [TP]  (value not drawn)
TP50  TP  [TP]  (value not drawn)
TP51  TP  [TP]  (value not drawn)
TP52  TP  [TP]  (value not drawn)
TP53  TP  [TP]  (value not drawn)

### Ports
EN_1V0 (in), EN_1V5 (in), EN_1V8 (in), EN_3V3 (in), LTM_1V5_OUT (bidir), LTM_1V8_OUT (bidir), LTM_1V_OUT (bidir), LTM_3V3_OUT (bidir), LTM_PGOOD (bidir)

### Nets
GND: C119.1 C120.1 C121.1 C122.1 C123.1 C523.1 C524.1 C525.1 C526.1 C527.1 IC33.A4(GND) IC33.A5(GND) IC33.B1(GND) IC33.B2(GND) IC33.C5(GND) IC33.D3(GND) IC33.D4(GND) IC33.D5(GND) IC33.E1(GND) IC33.E2(GND) IC33.F5(GND) IC33.F7(SGND) IC33.G3(GND) IC33.G4(GND) IC33.G5(GND) IC33.H1(GND) IC33.H2(GND) IC33.J5(GND) IC33.K3(GND) IC33.K4(GND) IC33.L1(GND) IC33.L2(GND) R425.1 R480.2 R482.1 R484.2 R489.1 R490.2 R504.1 R505.2
P3V3MP: R424.2
P5V0: R423.2
P12V0: C119.2 C120.2 IC33.B3(VIN1) IC33.B4(VIN1) IC33.E3(VIN2) IC33.E4(VIN2) IC33.H3(VIN3) IC33.H4(VIN3) IC33.L3(VIN4) IC33.L4(VIN4)
EN_1V0: IC33.C6(RUN1) ; port EN_1V0
EN_1V5: IC33.F6(RUN2) ; port EN_1V5
EN_1V8: IC33.K7(RUN4) ; port EN_1V8
EN_3V3: IC33.J6(RUN3) ; port EN_3V3
LTM_1V5_OUT: C123.2 IC33.C1(VOUT2) IC33.D1(VOUT2) IC33.D2(VOUT2) R481.2 ; port LTM_1V5_OUT
LTM_1V8_OUT: C526.2 IC33.J1(VOUT4) IC33.K1(VOUT4) IC33.K2(VOUT4) R491.2 ; port LTM_1V8_OUT
LTM_1V_OUT: C121.2 IC33.A1(VOUT1) IC33.A2(VOUT1) IC33.A3(VOUT1) R422.2 ; port LTM_1V_OUT
LTM_3V3_OUT: C524.2 IC33.F1(VOUT3) IC33.G1(VOUT3) IC33.G2(VOUT3) R488.2 ; port LTM_3V3_OUT
LTM_PGOOD: IC33.C2(PGOOD2) IC33.C3(PGOOD1) IC33.F2(PGOOD3) IC33.J2(PGOOD4) R424.1 ; port LTM_PGOOD
NetC122_2: C122.2 IC33.A6(TRACK/SS1)
NetC523_2: C523.2 IC33.D6(TRACK/SS2)
NetC525_2: C525.2 IC33.G6(TRACK/SS3)
NetC527_2: C527.2 IC33.K6(TRACK/SS4)
NetIC33_A7: IC33.A7(FB1) R422.1 R425.2
NetIC33_B5: IC33.B5(SVIN1) IC33.E5(SVIN2) IC33.H5(SVIN3) IC33.L5(SVIN4) R423.1
NetIC33_B6: IC33.B6(MODE1) R480.1
NetIC33_B7: IC33.B7(COMP1) TP24.1
NetIC33_C4: IC33.C4(INTVCC1) TP23.1
NetIC33_D7: IC33.D7(FB2) R481.1 R482.2
NetIC33_E6: IC33.E6(MODE2) R484.1
NetIC33_E7: IC33.E7(COMP2) TP26.1
NetIC33_F4: IC33.F4(INTVCC2) TP25.1
NetIC33_G7: IC33.G7(FB3) R488.1 R489.2
NetIC33_H6: IC33.H6(MODE3) R490.1
NetIC33_H7: IC33.H7(COMP3) TP51.1
NetIC33_J4: IC33.J4(INTVCC3) TP50.1
NetIC33_J7: IC33.J7(FB4) R491.1 R504.2
NetIC33_K5: IC33.K5(INTVCC4) TP52.1
NetIC33_L6: IC33.L6(MODE4) R505.1
NetIC33_L7: IC33.L7(COMP4) TP53.1

Not connected (* = marked no-connect by the designer): IC33 C7(CLKIN)* F3(TEMP) J3(CLKOUT)*

### Notes on the sheet
- undefined resistors are to support LTM4644A chip in case of issues with availability. The only difference is lack of internal feedback resistors.
  We use 5V as SVIN to improve efficiency
- Project/Equipment
- Document
- Designer
- Drawn by
- Check.by
- Copyright WUT ISE 2018.
  This documentation describes Open Hardware and is licensed under the CERN OHL v.1.1. You may redistribute and modify this documentation under the terms of the CERN OHL v.1.1. (http://ohwr.org/CERNOHL). This documentation is distributed WITHOUT ANY EXPRESS OR IMPLIED WARRANTY, INCLUDING OF MERCHANTABILITY, SATISFACTORY QUALITY AND FITNESS FOR A PARTICULAR PURPOSE. Please see the CERN OHL v.1.1 for applicable conditions.
- Contact
- File
- Last Mod.
- Print Date
- Sheet
- Size
- A3
- of
- Rev
- (in symbol R0402_10K_1%_0.0625W_100PPM) 1%
- (in symbol R0603_13K3_0.1%_0.063W_10PPM) 0.1%
- (in symbol R0603_30K1_0.1%_0.063W_10PPM) 0.1%
- (in symbol R0603_40K2_0.1%_0.063W_10PPM) 0.1%
- (in symbol R0603_90K9_1%_0.1W_100PPM) 1%

### Library data of the parts
C119 C120 = CC0805_22UF_16V_10%_X5R: as C116 on sheet PWR_DC_DC_EXAR2; Manufacturer Part Number: CC0805_22UF_16V_10%_X5R; Part Number: CC0805_22UF_16V_10%_X5R; Value: 22uF; Component Kind: Standard; Component Type: Standard; Pin Count: 2; Status: Preferred; Case: 0805; Mounted: Yes; Socket: No; SMD: Yes; Sense: No; Manufacturer1 Example: TDK; Manufacturer1 ComponentHeight: 1.35mm; HelpURL: \\cern.ch\dfs\Applications\Altium\Datasheets\CC0805_X5R_TDK_C.pdf; Author: CERN DEM JLC; CreateDate: 25.10.2012; LatestRevisionDate: 25.10.2012
C121 C123 C524 C526 = CC0805_47UF_6.3V_20%_X5R: Non-polarised capacitor; Manufacturer: GENERIC; Part Description: SMD Multilayer Chip Ceramic Capacitor; Manufacturer1 Part Number: C0805C476M9PACTU; Tolerance: ±20%; Voltage: 6.3V; TC: X5R; Manufacturer Part Number: CC0805_47UF_6.3V_20%_X5R; Part Number: CC0805_47UF_6.3V_20%_X5R; Value: 47uF; Component Kind: Standard; Component Type: Standard; Pin Count: 2; Status: Preferred; Case: 0805; Mounted: Yes; Socket: No; SMD: Yes; Sense: No; Manufacturer1 Example: KEMET; Manufacturer1 ComponentHeight: 1.4mm; HelpURL: \\cern.ch\dfs\Applications\Altium\Datasheets\CC0805_X5R_KEMET.pdf; Author: CERN DEM JLC; CreateDate: 16.10.2012; LatestRevisionDate: 16.10.2012
C122 C523 C525 C527 = CC0402_100NF_16V_10%_X5R: Non-polarised capacitor; Part Description: SMD Multilayer Chip Ceramic Capacitor; Manufacturer: GENERIC; Manufacturer1 Part Number: GRM155R61C104KA88D; Voltage: 16V; TC: X5R; Tolerance: ±10%; Part Number: CC0402_100NF_16V_10%_X5R; Component Kind: Standard; Component Type: Standard; Pin Count: 2; Value: 100nF; Status: None; Manufacturer Part Number: CC0402_100NF_16V_10%_X5R; Case: 0402; Mounted: Yes; Socket: No; SMD: Yes; Sense: No; Manufacturer1 Example: MURATA; Manufacturer1 ComponentHeight: 0.55mm; HelpURL: \\cern.ch\dfs\Applications\Altium\Datasheets\CC0402_X5R_MURATA_GRM.pdf; Author: CERN DEM JLC; CreateDate: 10.12.2013; LatestRevisionDate: 10.12.2013
IC33 = LTM4644IY#PBF: Quad DC/DC µModule Regulator with Configurable 4A Output Array; Part Description: 4V-14V to 0.6V-5.5V Quad DC/DC uModule (Power Module) Regulator with Configurable 4A Output Array; Manufacturer: LINEAR TECHNOLOGY; PressFit: No; Bonding: No; Part Number: LTM4644IY#PBF; Component Kind: Standard; Component Type: Standard; Device: LTM4644IY#PBF; PackageDescription: BGA, 1.27mm Pitch, Rect.; 77 Pin, 7 Columns X 11 Rows, 9.00mm X 15.00mm X 5.21mm H; Manufacturer Part Number: LTM4644IY#PBF; Pin Count: 77; Case: BGA77; Mounted: Yes; Socket: No; SMD: Yes; Sense: No; ComponentHeight: 5.21mm; HelpURL: \\cern.ch\dfs\Applications\Altium\Datasheets\LTM4644IY#PBF.pdf; Author: CERN DEM JLC; CreateDate: 25.04.2018; LatestRevisionDate: 25.04.2018
R422 R481 R488 R491 = R0603_NO-VALUE: Resistor; Part Description: Reserved Footprint For a 0603 (1608) Chip Resistor; PressFit: No; Mounted: No; Part Number: R0603_NO-VALUE; Component Kind: Standard; Component Type: Standard; Pin Count: 2; Value: Undefined; Status: None; Manufacturer: Undefined; Manufacturer Part Number: R0603_NO-VALUE; Case: 0603; Sense: No; Socket: No; SMD: Yes; Manufacturer1 Example: Undefined; Manufacturer1 Part Number: Undefined; Manufacturer1 ComponentHeight: Undefined; HelpURL: Undefined; Author: CERN DEM JLC; CreateDate: 03.12.2007; LatestRevisionDate: 13.03.2008
R423 R480 R484 R490 R505 = R0402_0R_JUMPER: Resistor; Manufacturer: GENERIC; Part Description: 1A (0.05R Max DC Resistance) Zero Ohm Jumper; Manufacturer1 Part Number: 232270591001L; PressFit: No; Manufacturer Part Number: R0402_0R_JUMPER; Part Number: R0402_0R_JUMPER; Value: 0; Component Kind: Standard; Component Type: Standard; Pin Count: 2; Status: Not Recommended; Case: 0402; Mounted: Yes; Sense: No; Socket: No; SMD: Yes; Manufacturer1 Example: YAGEO PHYCOMP; Manufacturer1 ComponentHeight: 0.4mm; HelpURL: \\cern.ch\dfs\Applications\Altium\Datasheets\R0402_Phycomp_RC0402.pdf; Author: CERN DEM JLC; CreateDate: 03.12.2007; LatestRevisionDate: 17.10.2012
R424 = R0402_10K_1%_0.0625W_100PPM: as R103 on sheet DAC_supply; Manufacturer Part Number: R0402_10K_1%_0.0625W_100PPM; Part Number: R0402_10K_1%_0.0625W_100PPM; Tolerance: ±1%; Value: 10k; Component Kind: Standard; Component Type: Standard; Pin Count: 2; Status: Not Recommended; Power: 0.0625W; Case: 0402; Mounted: Yes; Sense: No; Socket: No; SMD: Yes; Manufacturer1 Example: YAGEO PHYCOMP; Manufacturer1 ComponentHeight: 0.4mm; HelpURL: \\cern.ch\dfs\Applications\Altium\Datasheets\R0402_Phycomp_RC0402.pdf; Author: CERN DEM JLC; CreateDate: 03.12.2007; LatestRevisionDate: 17.10.2012
R425 = R0603_90K9_1%_0.1W_100PPM: Resistor - 1%; Part Description: General Purpose Thick Film Chip Resistor; Manufacturer: GENERIC; Manufacturer1 Part Number: CRCW060390K9FKEA; Power: 0.1W; TC: ±100ppm/°C; PressFit: No; Part Number: R0603_90K9_1%_0.1W_100PPM; Component Kind: Standard; Component Type: Standard; Pin Count: 2; Value: 90k9; Status: Preferred; Tolerance: ±1%; Manufacturer Part Number: R0603_90K9_1%_0.1W_100PPM; Case: 0603; Mounted: Yes; Sense: No; Socket: No; SMD: Yes; Manufacturer1 Example: VISHAY; Manufacturer1 ComponentHeight: 0.55mm; HelpURL: \\cern.ch\dfs\Applications\Altium\Datasheets\R0603_VISHAY_CRCW e3.pdf; Author: CERN DEM JLC; CreateDate: 14.03.2018; LatestRevisionDate: 14.03.2018
R482 = R0603_40K2_0.1%_0.063W_10PPM: Resistor - 0.1%; Part Description: Thin Film Chip Resistor; Manufacturer: GENERIC; Manufacturer1 Part Number: RN73C1J40K2BTDF; Power: 0.063W; TC: ±10ppm; PressFit: No; Part Number: R0603_40K2_0.1%_0.063W_10PPM; Component Kind: Standard; Component Type: Standard; Pin Count: 2; Value: 40k2; Status: Not Recommended; Tolerance: ±0.1%; Manufacturer Part Number: R0603_40K2_0.1%_0.063W_10PPM; Case: 0603; Mounted: Yes; Sense: No; Socket: No; SMD: Yes; Manufacturer1 Example: TYCO HOLSWORTHY; Manufacturer1 ComponentHeight: 0.5mm; HelpURL: \\cern.ch\dfs\Applications\Altium\Datasheets\R0603_Tyco_RN73.pdf; Author: CERN DEM JLC; CreateDate: 03.12.2007; LatestRevisionDate: 13.03.2008
R489 = R0603_13K3_0.1%_0.063W_10PPM: Resistor - 0.1%; Part Description: Thin Film Chip Resistor; Manufacturer: GENERIC; Manufacturer1 Part Number: RN73C1J13K3BTDF; Power: 0.063W; TC: ±10ppm; PressFit: No; Part Number: R0603_13K3_0.1%_0.063W_10PPM; Component Kind: Standard; Component Type: Standard; Pin Count: 2; Value: 13k3; Status: Not Recommended; Tolerance: ±0.1%; Manufacturer Part Number: R0603_13K3_0.1%_0.063W_10PPM; Case: 0603; Mounted: Yes; Sense: No; Socket: No; SMD: Yes; Manufacturer1 Example: TYCO HOLSWORTHY; Manufacturer1 ComponentHeight: 0.5mm; HelpURL: \\cern.ch\dfs\Applications\Altium\Datasheets\R0603_Tyco_RN73.pdf; Author: CERN DEM JLC; CreateDate: 03.12.2007; LatestRevisionDate: 13.03.2008
R504 = R0603_30K1_0.1%_0.063W_10PPM: Resistor - 0.1%; Part Description: Thin Film Chip Resistor; Manufacturer: GENERIC; Manufacturer1 Part Number: RN73C1J30K1BTDF; Power: 0.063W; TC: ±10ppm; PressFit: No; Part Number: R0603_30K1_0.1%_0.063W_10PPM; Component Kind: Standard; Component Type: Standard; Pin Count: 2; Value: 30k1; Status: Not Recommended; Tolerance: ±0.1%; Manufacturer Part Number: R0603_30K1_0.1%_0.063W_10PPM; Case: 0603; Mounted: Yes; Sense: No; Socket: No; SMD: Yes; Manufacturer1 Example: TYCO HOLSWORTHY; Manufacturer1 ComponentHeight: 0.5mm; HelpURL: \\cern.ch\dfs\Applications\Altium\Datasheets\R0603_Tyco_RN73.pdf; Author: CERN DEM JLC; CreateDate: 03.12.2007; LatestRevisionDate: 13.03.2008
TP23-TP26 TP50-TP53 = TP: Testpoint